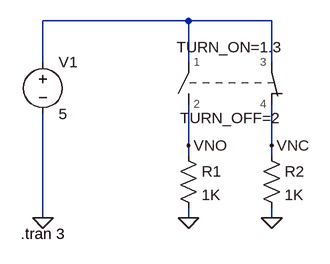
[diagram p0: schematic tcs_test.asc]
tcs_test.asc, the LTspice schematic file:
Version 4
SHEET 1 880 680
WIRE -208 144 -208 80
WIRE -208 384 -208 224
WIRE 16 80 -208 80
WIRE 16 144 16 80
WIRE 16 272 16 208
WIRE 16 288 16 272
WIRE 16 384 16 368
WIRE 144 80 16 80
WIRE 144 144 144 80
WIRE 144 272 144 208
WIRE 144 288 144 272
WIRE 144 384 144 368
FLAG 16 384 0
FLAG 144 384 0
FLAG -208 384 0
FLAG 16 272 VNO
FLAG 144 272 VNC
SYMBOL Time\ Controlled\ Switch 80 176 R0
WINDOW 0 0 0 Invisible 0
SYMATTR InstName U1
SYMATTR SpiceLine TURN_ON=1.3
SYMBOL voltage -208 128 R0
WINDOW 123 0 0 Left 0
WINDOW 39 0 0 Left 0
SYMATTR InstName V1
SYMATTR Value 5
SYMBOL res 0 272 R0
SYMATTR InstName R1
SYMATTR Value 1K
SYMBOL res 128 272 R0
SYMATTR InstName R2
SYMATTR Value 1K
TEXT -242 408 Left 0 !.tran 3

The netlist it stands for:
* tcs_test.asc
XU1 N001 VNO N001 VNC TCS TURN_ON=1.3 TURN_OFF=2  ; pins 1 2 3 4
V1 N001 0 5
R1 VNO 0 1K
R2 VNC 0 1K
.tran 3
.lib time_switch.LIB
.backanno
.end